# Altium schematic sheet WIFI.schdoc: =
size A4; Symbol: Sheet-Symbol_A4; Company: 嘉立创EDA; Version: V1.0; Page Size: A4; @Project Name: RK3568B2地瓜派; @Page Count: 27; @Update Date: 2025-09-15; @Create Date: 2025-09-11; @Schematic Name: Schematic1; @Page No: 23; @Page Name: WIFI; Device: Sheet-Symbol_A4; Border: 1; Title Block Position: 3; Width: 1170; Height: 825; Region Start: 1; X Region Count: 6; Y Region Count: 4; Blade Width: 10; @Board Name: Board1; @Create Time: 22:26:48; @Update Time: 13:26:38; Organization: ORGANIZATION; Address1: ADDRESS 1; Address2: ADDRESS 2; Address3: ADDRESS 3; Address4: ADDRESS 4; SheetNumber: 28; SheetTotal: 28
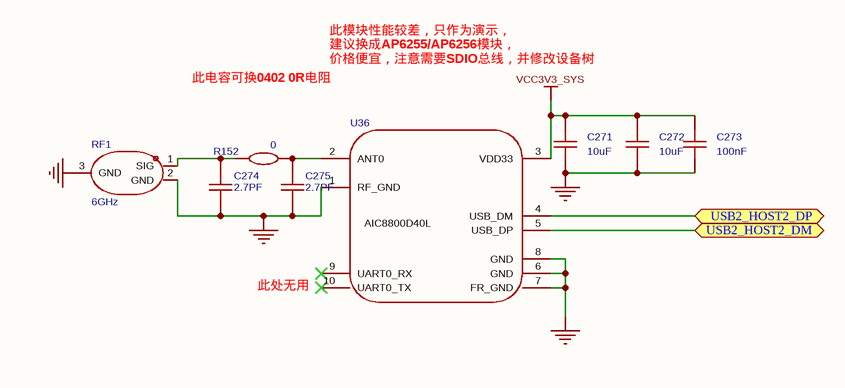
[diagram p0: WIFI.schdoc]

## Parts
C271  10uF  [C0603]
C272  10uF  [C0603]
C273  100nF  [C0603]
C274  2.7PF  [MYC0402]
C275  2.7PF  [MYC0402]
R152  0  [R0402]
RF1  6GHz  [IPEX-SMD_BWIPX-1-001E]
U36  (no value)  [BL_M8800DU6_40L]

## Ports
USB2_HOST2_DM (bidir), USB2_HOST2_DP (bidir)

## Nets
GND: C271.1 C272.1 C273.1 C274.1 C275.1 RF1.2(GND) RF1.3(GND) U36.1(RF_GND) U36.6(GND) U36.7(FR_GND) U36.8(GND)
VCC3V3_SYS: C271.2 C272.2 C273.2 U36.3(VDD33)
USB2_HOST2_DM: U36.5(USB_DP) ; port USB2_HOST2_DM
USB2_HOST2_DP: U36.4(USB_DM) ; port USB2_HOST2_DP
NetC274_2: C274.2 R152.1 RF1.1(SIG)
NetC275_2: C275.2 R152.2 U36.2(ANT0)

Not connected (* = marked no-connect by the designer): U36 9(UART0_RX)* 10(UART0_TX)*

## Notes on the sheet
- 此电容可换0402 0R电阻
- (near U36) 此模块性能较差，只作为演示，
  建议换成AP6255/AP6256模块，
  价格便宜，注意需要SDIO总线，并修改设备树
- 此处无用
- Drawn By :
- Checked By :
- Approved By :
- SheetNumber
- SheetTotal
- Revision :
- Time :
- Size :
- Date :
- A4
- DocumentName :
- Project :
- (in symbol BL_M8800DU6_40L) AIC8800D40L

## Library data of the parts
C271 C272 = CAP_0603: Symbol: Capacitance; ConvertToPcb: yes; ModelId: ac125912035d415993ca9572d50418b1聨0819f05c4eef4c71ace90d822a990e87; ModelName: C0603_L1.6-W0.8-H0.8; ModelTransform: 62.992,31.496,0,0,0,0,0,0,0; Device: CAP_0603; Value: 10uF; AddInBom: yes; Supplier Footprint: 0603; FootprintName: C0603
C273 = CAP_0603: Symbol: Capacitance; Value: 10uF; ConvertToPcb: yes; ModelId: ac125912035d415993ca9572d50418b1聨0819f05c4eef4c71ace90d822a990e87; ModelName: C0603_L1.6-W0.8-H0.8; ModelTransform: 62.992,31.496,0,0,0,0,0,0,0; Device: CAP_0603; AddInBom: yes; Supplier Footprint: 0603; FootprintName: C0603
C274 C275 = CAP_0402: Symbol: Capacitance; ConvertToPcb: yes; ModelId: 36a51122f27c49738f86b3bfa98863e0; ModelName: C0402_L1.0-W0.5-H0.5; ModelTransform: 39.37,19.685,0,0,0,0,0,0,0; Value: 2.7PF; Device: CAP_0402; AddInBom: yes; Supplier Footprint: 0402; FootprintName: MYC0402
R152 = Res_0402: Symbol: 电阻; ConvertToPcb: yes; ModelId: 671aefced39d4c318694bba8bd8efd39; ModelName: R0402_L1.0-W0.5-H0.5; ModelTransform: 39.37,19.685,0,0,0,0,0,0.0005,0; Value: 0; Device: Res_0402; AddInBom: yes; Supplier Footprint: 0402; FootprintName: R0402
RF1 = BWIPX-1-001E: 连接器类型:板端;接口类型:内针;端口数量:1;接口直径:-;接口长度/高度:-;频率:6GHz;射频系列:IPEX;阻抗:50Ω;样式:-;工作温度:-;; Manufacturer: BAT WIRELESS(蝙蝠无线); AddInBom: yes; ModelId: e9910d1cc3f644ef905f39c3184653d7; ModelTransform: 122.047,118.11,0,180,0,0,29.921,0,0; Connector Type: 板端; Interface: 内针; Number of Ports: 1; RF Series: IPEX; Impedance: 50Ω; Symbol: BWIPX-1-001E; Device: BWIPX-1-001E; LCSC Part Name: IPEX 内针; SupplierPart: C496552; ManufacturerPart: BWIPX-1-001E; Supplier Footprint: SMD; JLCPCB Part Class: 扩展库; Datasheet: https://item.szlcsc.com/datasheet/BWIPX-1-001E/508501.html; Supplier: LCSC; ConvertToPcb: yes; FootprintName: IPEX-SMD_BWIPX-1-001E; ModelName: IPEX-SMD_BWIPX-1-001E; Interface Diameter: -; Interface Length/Height: -; Value: 6GHz; Style: -; Operating Temperature Range: -
U36 = BL_M8800DU6_40L: AIC8800D40L双频5G无线模块wifi6+BLE蓝牙配网IPC摄像头投屏图传; AddInBom: yes; Device: BL_M8800DU6_40L; ConvertToPcb: yes; SymbolName: BL_M8800DU6_40L; FootprintName: BL_M8800DU6_40L